# EAGLE design main_board (EAGLE 5.10)
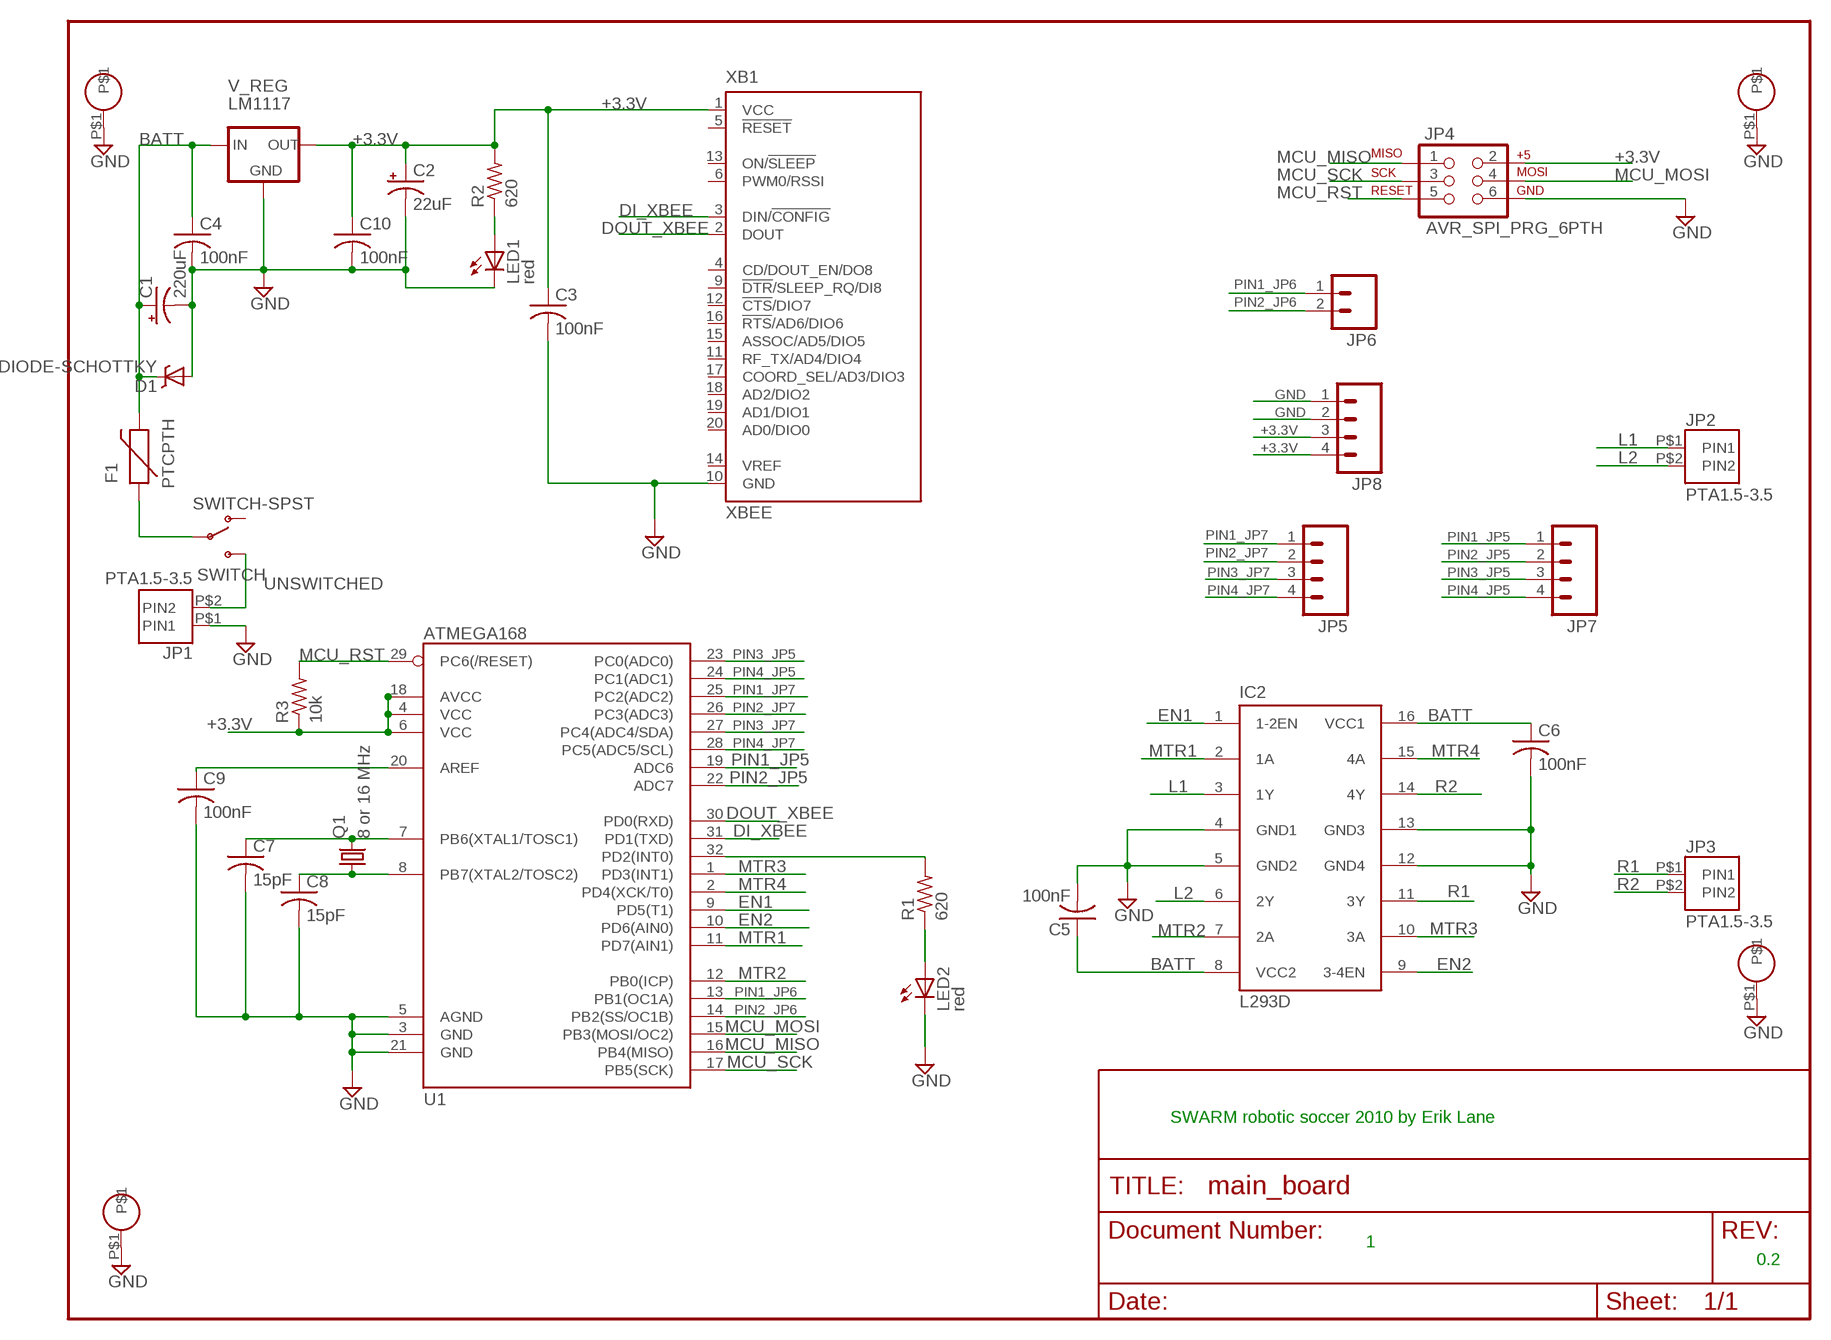
[diagram p0: schematic, sheet 1]

## Parts
C1  220uF  CPOL-USE5-6  [E5-6]
C2  22uF  CPOL-USE5-6  [E5-6]
C3  100nF  C-US050-024X044  [C050-024X044]
C4  100nF  C-US050-024X044  [C050-024X044]
C5  100nF  C-US050-024X044  [C050-024X044]
C6  100nF  C-US050-024X044  [C050-024X044]
C7  15pF  C-US050-024X044  [C050-024X044]
C8  15pF  C-US050-024X044  [C050-024X044]
C9  100nF  C-US050-024X044  [C050-024X044]
C10  100nF  C-US050-024X044  [C050-024X044]
D1  DIODE-SCHOTTKY  [SCHOTTKY]
F1  PTCPTH  [PTC]
IC2  L293D  [DIL16]
JP1  PTA1.5-3.5  [PTA1.5-3.5]
JP2  PTA1.5-3.5  [PTA1.5-3.5]
JP3  PTA1.5-3.5  [PTA1.5-3.5]
JP4  AVR_SPI_PRG_6PTH  [2X3]
JP5  M041X04_NO_SILK  [1X04_NO_SILK]
JP6  M02PTH  [1X02]
JP7  M041X04_NO_SILK  [1X04_NO_SILK]
JP8  M041X04_NO_SILK  [1X04_NO_SILK]
LED1  red  LED3MM  [LED3MM]
LED2  red  LED3MM  [LED3MM]
Q1  8 or 16 MHz  CRYSTALHC49US  [HC49US]
R1  620  R-US_0204/5  [0204/5]
R2  620  R-US_0204/5  [0204/5]
R3  10k  R-US_0204/5  [0204/5]
SWITCH  SWITCH-SPST  [SWITCH]
U1  ATMEGA168  [TQFP32-08]
U$2  BOARD-MOUNT  [MOUNT]
U$3  BOARD-MOUNT  [MOUNT]
U$4  BOARD-MOUNT  [MOUNT]
U$5  BOARD-MOUNT  [MOUNT]
V_REG  LM1117  V_REG_LM1117_SOT223  [SOT223]
XB1  XBEE  [XBEE]

## Nets
+3.3V [3.3V]: C2.+ C3.1 C10.1 JP4.2 JP8.3 JP8.4 R2.2 R3.1 U1.4(VCC) U1.6(VCC) U1.18(AVCC) V_REG.2(OUT) XB1.1(VCC)
BATT [power]: C1.+ C4.1 C5.1 C6.1 D1.1(C) F1.P$2 IC2.8(VCC2) IC2.16(VCC1) V_REG.3(IN)
DI_XBEE: U1.31(PD1(TXD)) XB1.3(DIN/!CONFIG)
DOUT_XBEE: U1.30(PD0(RXD)) XB1.2(DOUT)
EN1: IC2.1(1-2EN) U1.9(PD5(T1))
EN2: IC2.9(3-4EN) U1.10(PD6(AIN0))
GND: C1.- C2.- C3.2 C4.2 C5.2 C6.2 C7.2 C8.2 C9.2 C10.2 D1.2(A) IC2.4(GND1) IC2.5(GND2) IC2.12(GND4) IC2.13(GND3) JP1.P$1(PIN1) JP4.6 JP8.1 JP8.2 LED1.K(C) LED2.K(C) U1.3(GND) U1.5(AGND) U1.21(GND) U$2.P$1 U$3.P$1 U$4.P$1 U$5.P$1 V_REG.1(GND) XB1.10(GND)
L1 [motor]: IC2.3(1Y) JP2.P$1(PIN1)
L2 [motor]: IC2.6(2Y) JP2.P$2(PIN2)
MCU_MISO: JP4.1 U1.16(PB4(MISO))
MCU_MOSI: JP4.4 U1.15(PB3(MOSI/OC2))
MCU_RST: JP4.5 R3.2 U1.29(PC6(/RESET))
MCU_SCK: JP4.3 U1.17(PB5(SCK))
MTR1: IC2.2(1A) U1.11(PD7(AIN1))
MTR2: IC2.7(2A) U1.12(PB0(ICP))
MTR3: IC2.10(3A) U1.1(PD3(INT1))
MTR4: IC2.15(4A) U1.2(PD4(XCK/T0))
N$1 [power]: F1.P$1 SWITCH.2(P)
N$2: R1.2 U1.32(PD2(INT0))
N$3: C7.1 Q1.2 U1.7(PB6(XTAL1/TOSC1))
N$4: C8.1 Q1.1 U1.8(PB7(XTAL2/TOSC2))
N$5: C9.1 U1.20(AREF)
N$6: LED1.A R2.1
N$7: LED2.A R1.1
PIN1_JP5: JP7.1 U1.19(ADC6)
PIN1_JP6: JP6.1 U1.13(PB1(OC1A))
PIN1_JP7: JP5.1 U1.25(PC2(ADC2))
PIN2_JP5: JP7.2 U1.22(ADC7)
PIN2_JP6: JP6.2 U1.14(PB2(SS/OC1B))
PIN2_JP7: JP5.2 U1.26(PC3(ADC3))
PIN3_JP5: JP7.3 U1.23(PC0(ADC0))
PIN3_JP7: JP5.3 U1.27(PC4(ADC4/SDA))
PIN4_JP5: JP7.4 U1.24(PC1(ADC1))
PIN4_JP7: JP5.4 U1.28(PC5(ADC5/SCL))
R1 [motor]: IC2.11(3Y) JP3.P$1(PIN1)
R2 [motor]: IC2.14(4Y) JP3.P$2(PIN2)
UNSWITCHED [power]: JP1.P$2(PIN2) SWITCH.3(S)
Unconnected: SWITCH.1(O) XB1.4(CD/DOUT_EN/DO8) XB1.5(!RESET) XB1.6(PWM0/RSSI) XB1.9(!DTR!/SLEEP_RQ/DI8) XB1.11(RF_TX/AD4/DIO4) XB1.12(!CTS!/DIO7) XB1.13(ON/!SLEEP) XB1.14(VREF) XB1.15(ASSOC/AD5/DIO5) XB1.16(!RTS!/AD6/DIO6) XB1.17(COORD_SEL/AD3/DIO3) XB1.18(AD2/DIO2) XB1.19(AD1/DIO1) XB1.20(AD0/DIO0)

## Notes on the sheet
- SWARM robotic soccer 2010 by Erik Lane
- 1
- 0.2

## Library data of the parts
C1 C2 = rcl:CPOL-US: POLARIZED CAPACITOR, American symbol
C3-C10 = rcl:C-US: CAPACITOR, American symbol
D1 = ErikLane:DIODE-SCHOTTKY
F1 = SparkFun:PTC: Resettable Fuse PTC Resettable Fuse. Spark Fun Electronics SKU : COM-08357
IC2 = st-microelectronics:L293D: PUSH-PULL 4 CHANNEL DRIVER
JP1-JP3 = ErikLane:PTA1.5-3.5
JP4 = SparkFun:AVR_SPI_PRG_6: AVR ISP 6 Pin This is the reduced ISP connector for AVR programming. Common on Arduino. This footprint will take up less PCB space and can be used with a 10-pin to 6-pin adapter such as SKU: BOB-08508
JP5 JP7 JP8 = SparkFun:M04: Header 4 Standard 4-pin 0.1" header. Use with straight break away headers (SKU : PRT-00116), right angle break away headers (PRT-00553), swiss pins (PRT-00743), machine pins (PRT-00117), and female headers (PRT-00115). Molex polarized connector foot print use with SKU : PRT-08231 with associated crimp pins and housings.
JP6 = SparkFun:M02: Header 2 Standard 2-pin 0.1" header. Use with straight break away headers (SKU : PRT-00116), right angle break away headers (PRT-00553), swiss pins (PRT-00743), machine pins (PRT-00117), and female headers (PRT-00115). Molex polarized connector foot print use with SKU : PRT-08233 with associated crimp pins and housings.
LED1 LED2 = led:LED: LED OSRAM: - CHIPLED LG R971, LG N971, LY N971, LG Q971, LY Q971, LO R971, LY R971 LH N974, LH R974 LS Q976, LO Q976, LY Q976 LO Q996 - Hyper CHIPLED LW Q18S LB Q993, LB Q99A, LB R99A - SideLED LS A670, LO A670, LY A670, LG A670, LP A670 LB A673, LV A673, LT A673, LW A673 LH A674 LY A675 LS A676, LA A676, LO A676, LY A676, LW A676 LS A679, LY A679, LG A679 - Hyper Micro SIDELED® LS Y876, LA Y876, LO Y876, LY Y876 LT Y87S - SmartLED LW L88C, LW L88S LB L89C, LB L89S, LG L890 LS L89K, LO L89K, LY L89K LS L896, LA L896, LO L896, LY L896 - TOPLED LS T670, LO T670, LY T670, LG T670, LP T670 LSG T670, LSP T670, LSY T670, LOP T670, LYG T670 LG T671, LOG T671, LSG T671 LB T673, LV T673, LT T673, LW T673 LH T674 LS T676, LA T676, LO T676, LY T676, LB T676, LH T676, LSB T676, LW T676 LB T67C, LV T67C, LT T67C, LS T67K, LO T67K, LY T67K, LW E67C LS E67B, LA E67B, LO E67B, LY E67B, LB E67C, LV E67C, LT E67C LW T67C LS T679, LY T679, LG T679 LS T770, LO T770, LY T770, LG T770, LP T770 LB T773, LV T773, LT T773, LW T773 LH T774 LS E675, LA E675, LY E675, LS T675 LS T776, LA T776, LO T776, LY T776, LB T776 LHGB T686 LT T68C, LB T68C - Hyper Mini TOPLED® LB M676 - Mini TOPLED Santana® LG M470 LS M47K, LO M47K, LY M47K Source: http://www.osram.convergy.de LUXEON: - LUMILED® LXK2-PW12-R00, LXK2-PW12-S00, LXK2-PW14-U00, LXK2-PW14-V00 LXK2-PM12-R00, LXK2-PM12-S00, LXK2-PM14-U00 LXK2-PE12-Q00, LXK2-PE12-R00, LXK2-PE12-S00, LXK2-PE14-T00, LXK2-PE14-U00 LXK2-PB12-K00, LXK2-PB12-L00, LXK2-PB12-M00, LXK2-PB14-N00, LXK2-PB14-P00, LXK2-PB14-Q00 LXK2-PR12-L00, LXK2-PR12-M00, LXK2-PR14-Q00, LXK2-PR14-R00 LXK2-PD12-Q00, LXK2-PD12-R00, LXK2-PD12-S00 LXK2-PH12-R00, LXK2-PH12-S00 LXK2-PL12-P00, LXK2-PL12-Q00, LXK2-PL12-R00 Source: www.luxeon.com KINGBRIGHT: KA-3528ASYC Source: www.kingbright.com
Q1 = SparkFun:CRYSTAL: Crystals Various standard crystals. Proven footprints. Spark Fun Electronics SKU : COM-00534
R1-R3 = rcl:R-US_: RESISTOR, American symbol
SWITCH = ErikLane:SWITCH-SPST
U1 = SparkFun:ATMEGA168
U$2-U$5 = ErikLane:BOARD-MOUNT
V_REG = SparkFun:V_REG_LM1117_SOT223: LM1117 because SparkFun didn't have one already set up to do this.
XB1 = maxstream:XBEE: XBee (TM) /XBee-PRO(TM) OEM RF Modules Source: MaxStream, Inc. xbee_productmanual.pdf

## Net classes
0 default: width 0.203 mm, clearance 0.127 mm
1 power: width 1.016 mm, clearance 0.127 mm
2 motor: width 0.406 mm, clearance 0.127 mm
3 3.3V: width 0.406 mm, clearance 0.127 mm

## Board
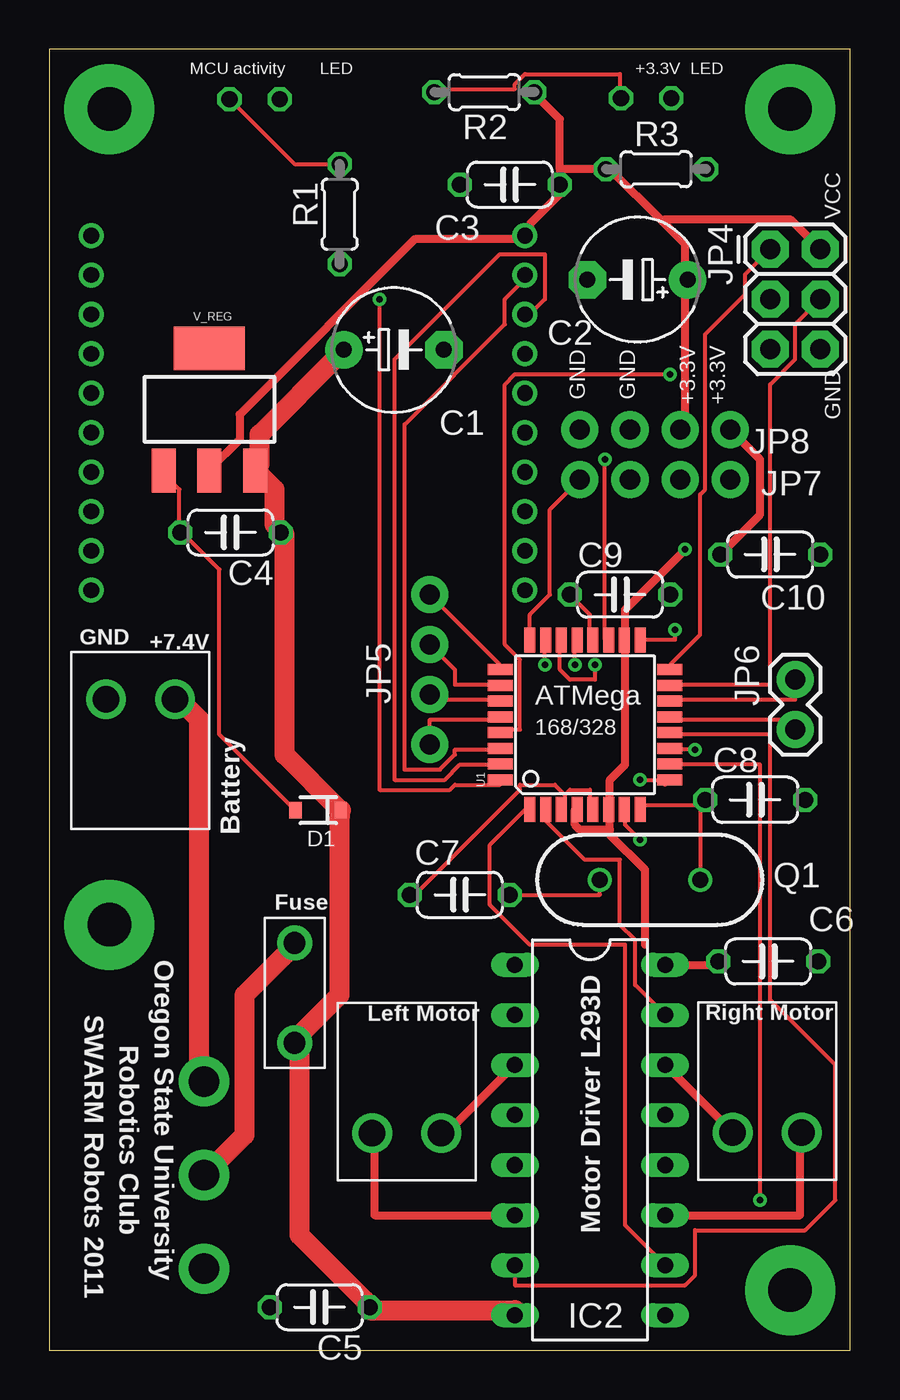
[diagram p1: board, top side]
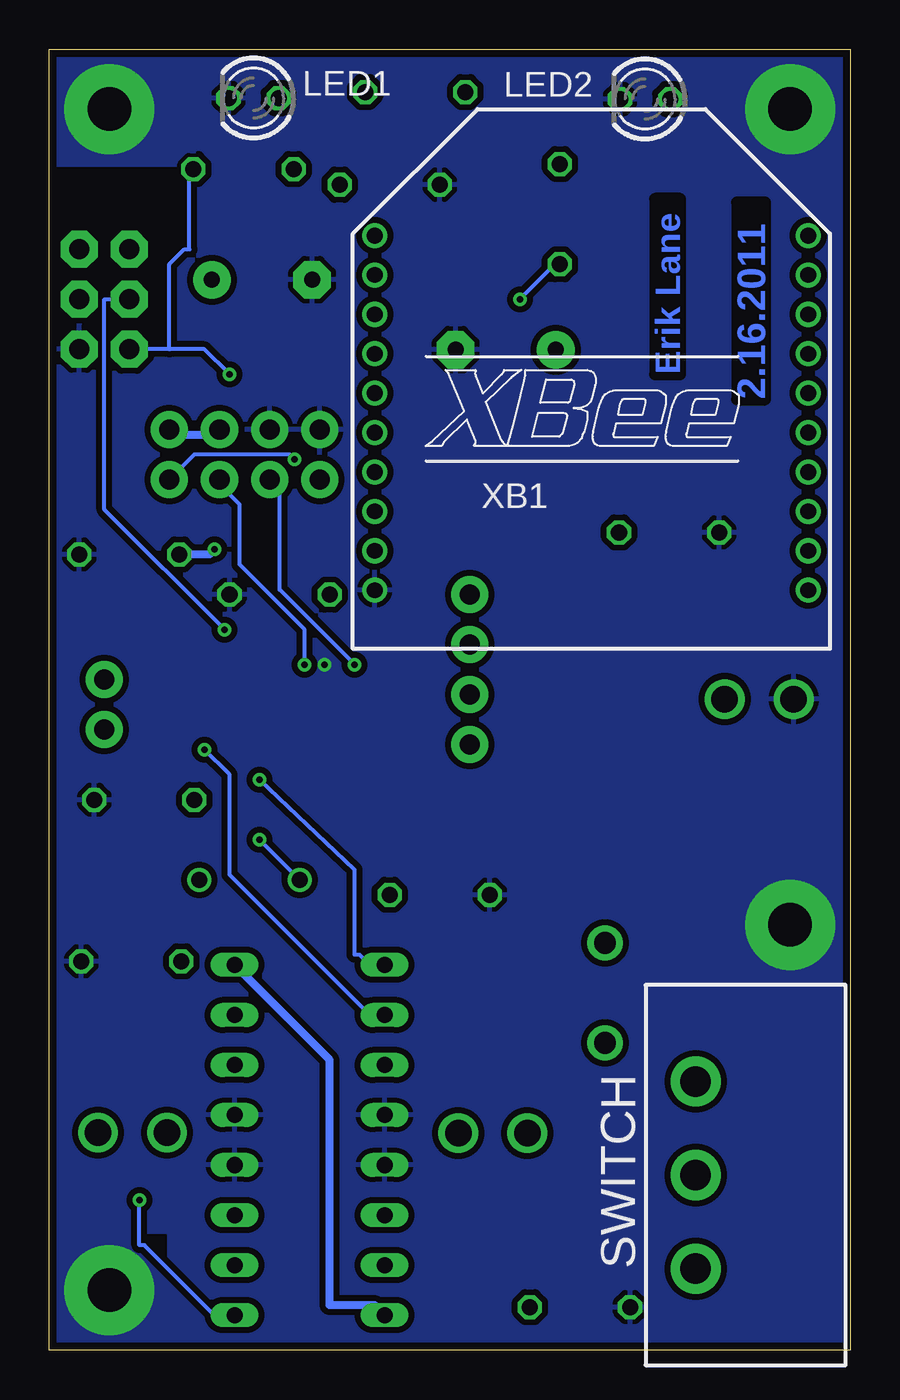
[diagram p2: board, bottom side, seen from below]

Size 40.64 x 66.03 mm. Coordinates in mm from the lower left corner, seen from the top.
Outline: 0,0 40.64,0 40.64,66.03 0,66.03 0,0
Copper layers (1*16): Top 0.0356mm / dielectric 1.5011mm / Bottom 0.0356mm
Design rules "LaenPCBOrder *": minimum track width 6mil, minimum drill 13mil, track to track 8mil, track to pad 8mil, pad to pad 8mil, via to via 8mil, smd to smd 6mil, copper to edge 15mil, drill to drill 6mil, minimum pad ring 7mil, minimum via ring 7mil, stop-mask expansion 4mil, vias tented up to drill 0mil, thermal gap 10mil

### Footprints (pad centres in the part's own frame; a part is rotated, then mirrored left to right if it is on the bottom)
E5-6 = drill 0.813 pad 1.905 round: + -2.54,0 | drill 0.813 pad 1.905 octagon: - 2.54,0
C050-024X044 = drill 0.813 octagon: 1 -2.54,0; 2 2.54,0
SCHOTTKY = smd 0.63 x 0.83: 1 -1.15,0; 2 1.15,0
PTC = drill 1.1 pad 1.778 round: P$1 -2.54,0; P$2 2.54,0
DIL16 = drill 0.813 long: 1 -8.89,-3.81; 2 -6.35,-3.81; 3 -3.81,-3.81; 4 -1.27,-3.81; 5 1.27,-3.81; 6 3.81,-3.81; 7 6.35,-3.81; 8 8.89,-3.81; 9 8.89,3.81; 10 6.35,3.81; 11 3.81,3.81; 12 1.27,3.81; 13 -1.27,3.81; 14 -3.81,3.81; 15 -6.35,3.81; 16 -8.89,3.81
PTA1.5-3.5 = drill 1.346 round: P$1 3.5,0; P$2 0,0
2X3 = drill 1.016 pad 1.88 octagon: 1 0,0; 2 0,2.54; 3 2.54,0; 4 2.54,2.54; 5 5.08,0; 6 5.08,2.54
1X04_NO_SILK = drill 1.016 pad 1.88 round: 1 0,0; 2 2.54,0; 3 5.08,0; 4 7.62,0
1X02 = drill 1.016 pad 1.88 round: 1 0,0; 2 2.54,0
LED3MM = drill 0.813 octagon: A -1.27,0; K 1.27,0
HC49US = drill 0.813 round: 1 -2.54,0; 2 2.54,0
0204/5 = drill 0.813 octagon: 1 -2.54,0; 2 2.54,0
SWITCH = drill 1.549 pad 2.54 round: 1 0,4.75; 2 0,0; 3 0,-4.75
TQFP32-08 = smd 1.27 x 0.559: 1 -4.293,2.8; 2 -4.293,2; 3 -4.293,1.2; 4 -4.293,0.4; 5 -4.293,-0.4; 6 -4.293,-1.2; 7 -4.293,-2; 8 -4.293,-2.8; 17 4.293,-2.8; 18 4.293,-2; 19 4.293,-1.2; 20 4.293,-0.4; 21 4.293,0.4; 22 4.293,1.2; 23 4.293,2; 24 4.293,2.8 | smd 0.559 x 1.27: 9 -2.8,-4.293; 10 -2,-4.293; 11 -1.2,-4.293; 12 -0.4,-4.293; 13 0.4,-4.293; 14 1.2,-4.293; 15 2,-4.293; 16 2.8,-4.293; 25 2.8,4.293; 26 2,4.293; 27 1.2,4.293; 28 0.4,4.293; 29 -0.4,4.293; 30 -1.2,4.293; 31 -2,4.293; 32 -2.8,4.293
MOUNT = drill 2.21 pad 4.572 round: P$1 0,0
SOT223 = smd 1.219 x 2.235: 1 -2.311,-3.099; 2 0,-3.099; 3 2.311,-3.099 | smd 3.6 x 2.2: 4 0,3.099
XBEE = drill 0.8 pad 1.27 round: 1 -11,9; 2 -11,7; 3 -11,5; 4 -11,3; 5 -11,1; 6 -11,-1; 7 -11,-3; 8 -11,-5; 9 -11,-7; 10 -11,-9; 11 11,-9; 12 11,-7; 13 11,-5; 14 11,-3; 15 11,-1; 16 11,1; 17 11,3; 18 11,5; 19 11,7; 20 11,9

### Placement (x,y rotation side)
C1  17.48,50.78 0 top
C2  29.84,54.33 180 top
C3  23.37,59.16 180 top
C4  9.19,41.5 180 top
C5  13.72,2.18 180 top
C6  36.47,19.74 0 top
C7  20.83,23.11 180 top
C8  35.81,27.94 0 top
C9  28.96,38.35 0 top
C10  36.58,40.39 0 top
D1  13.64,27.41 180 top
F1  12.45,18.14 270 top
IC2  27.43,10.67 270 top
JP1  6.38,33.05 180 top
JP2  16.38,11.02 0 top
JP3  34.67,11.05 0 top
JP4  36.58,55.88 270 top
JP5  19.3,38.35 270 top
JP6  37.85,31.5 90 top
JP7  34.54,44.2 180 top
JP8  26.92,46.74 0 top
LED1  30.28,63.55 180 bottom
LED2  10.41,63.5 180 bottom
Q1  30.48,23.88 180 top
R1  14.73,57.66 270 top
R2  22.07,63.86 0 top
R3  30.78,59.94 0 top
SWITCH  7.85,8.89 180 bottom
U1  27.18,31.75 90 top
U$2  37.59,3.05 0 top
U$3  3.05,21.59 0 top
U$4  3.05,62.99 0 top
U$5  37.59,62.99 0 top
V_REG  8.13,47.75 0 top
XB1  13.13,47.57 0 bottom

### Tracks (layer width: path | path; a pad name or v marks a point on that pad's centre or on a via)
+3.3V  (via drill 0.33)
  Top 0.406: C3.1 25.91,58.67 24.38,57.15 24.38,56.64 XB1.1 24.13,56.39 18.54,56.39 9.65,47.5 9.65,46.23 8.13,44.7 V_REG.2 | R2.2 24.64,63.75 25.91,62.48 25.91,59.94 | 25.91,59.94 C3.1 | C3.1 25.91,58.93 | 28.45,26.42 26.92,26.42 26.67,26.67 26.67,27.43 U1.4 | 28.45,26.42 28.45,27.43 U1.6 28.45,27.69 28.45,28.96 29.21,29.72 29.21,35.81 U1.18 29.21,36.07 29.21,37.59 v32.26,40.64 | 30.23,20.57 30.23,24.38 28.45,26.16 28.45,26.42 | C10.1 36.07,42.42 36.07,45.21 JP8.4 | 25.91,59.94 R3.1 28.45,59.94 31.11,57.28 | 31.11,57.28 32.26,56.13 32.26,54.36 C2.+ 32.26,54.1 32.26,46.99 JP8.3 | JP4.2 37.59,57.4 31.24,57.4 31.11,57.28
  Bottom 0.406: JP8.4 34.29,46.48 32.26,46.48 JP8.3 | v32.26,40.64 32.51,40.39 C10.1
BATT
  Top 0.406: IC2.16 33.78,19.56 C6.1
  Top 1.016: IC2.8 23.62,2.03 16.26,2.03 C5.1 16,2.54 12.7,5.84 12.7,15.24 F1.P$2 12.45,15.75 14.73,18.03 14.73,26.92 D1.1 14.73,27.43 11.94,30.23 11.94,41.4 C4.1 11.43,41.91 11.43,43.69 10.67,44.45 V_REG.3 10.67,44.96 10.67,46.48 14.73,50.55 C1.+
  Bottom 0.406: IC2.16 26.42,14.73 26.42,2.29 24.13,2.29 IC2.8
DI_XBEE
  Top 0.203: U1.31 22.86,29.72 20.83,29.72 20.07,28.96 17.53,28.96 17.53,50.29 22.86,55.63 25.15,55.63 25.15,53.34 24.38,52.58 XB1.3
DOUT_XBEE
  Top 0.203: U1.30 22.86,30.48 20.57,30.48 20.57,30.23 19.81,29.46 18.03,29.46 18.03,46.99 23.11,52.07 23.11,53.34 24.13,54.36 XB1.2
EN1  (via drill 0.33)
  Top 0.203: 31.24,28.7 U1.9 31.24,28.96 v29.97,28.96
  Bottom 0.203: v29.97,28.96 25.15,24.38 25.15,20.07 24.89,20.07 24.38,19.56 IC2.1
EN2  (via drill 0.33)
  Top 0.203: v36.07,7.62 36.07,29.72 31.5,29.72 U1.10
  Bottom 0.203: v36.07,7.62 36.07,5.33 35.81,5.33 32.26,1.78 IC2.9
GND  (via drill 0.33)
  Top 0.203: 26.16,28.19 26.16,27.69 U1.3 | 26.16,28.19 26.42,28.45 27.43,28.45 27.43,27.69 U1.5 | v26.67,34.8 26.67,35.81 U1.21 | 26.16,28.19 25.65,28.7 23.88,28.7 23.88,28.45 18.54,23.11 C7.2 | V_REG.1 5.84,44.45 6.6,43.69 6.6,41.66 C4.2 6.86,41.4 8.64,39.62 8.64,31.24 12.45,27.43 D1.2
  pour Bottom (isolate 0.305): 6.22,65.81 33.68,65.86 34.14,60.27 40.54,60.15 40.41,5.94 34.54,6.05 34.52,0.13 0.23,0.2 0.25,18.44 6.71,18.49 6.6,24.77 0.18,24.84 0.2,59.87 5.66,59.92 6.35,62.51
  pour Bottom (isolate 0.305, no thermals): 33.73,6.07 40.44,6.07 40.46,0.13 33.45,0.18
  pour Bottom (isolate 0.305, no thermals): 0.13,24.84 6.88,24.84 6.86,18.52 0.18,18.52
  pour Bottom (no thermals): 33.53,65.79 40.39,65.79 40.39,60.2 33.27,60.2
  pour Bottom (no thermals): 0.25,65.79 6.6,65.79 6.1,59.94 0.25,59.94
L1
  Top 0.406: IC2.3 20.07,10.92 JP2.P$1
L2
  Top 0.406: IC2.6 16.51,6.86 16.51,10.92 JP2.P$2
MCU_MISO
  Top 0.203: JP4.1 35.31,54.61 35.31,53.59 33.27,51.56 33.27,43.69 33.02,43.43 33.02,36.32 31.5,34.8 U1.16
MCU_MOSI
  Top 0.203: JP4.4 37.85,52.07 37.85,50.29 36.58,49.02 36.58,33.78 31.5,33.78 U1.15
MCU_RST  (via drill 0.33)
  Top 0.203: v31.5,49.53 23.62,49.53 23.11,49.02 23.11,35.81 23.88,35.05 23.88,31.5 23.11,31.5 U1.29
  Bottom 0.203: v31.5,49.53 32.77,50.8 34.54,50.8 | 34.54,50.8 JP4.5 | 34.54,50.8 34.54,55.12 33.78,55.88 33.53,55.88 33.53,59.94 R3.2
MCU_SCK  (via drill 0.33)
  Top 0.203: v31.75,36.58 31.75,36.07 30.23,36.07 U1.17
  Bottom 0.203: v31.75,36.58 37.85,42.67 37.85,53.34 JP4.3
MTR1  (via drill 0.33)
  Top 0.203: v32.77,30.48 31.5,30.48 U1.11
  Bottom 0.203: v32.77,30.48 31.5,29.21 31.5,24.13 24.38,17.02 IC2.2
MTR2
  Top 0.203: IC2.7 23.62,3.3 32.26,3.3 32.77,3.81 32.77,6.1 38.35,6.1 39.88,7.62 39.88,14.48 36.58,17.78 36.58,31.24 31.5,31.24 U1.12
MTR3
  Top 0.203: IC2.10 29.21,6.35 29.21,20.57 24.38,20.57 22.35,22.61 22.35,25.65 24.13,27.43 U1.1
MTR4
  Top 0.203: IC2.15 29.72,18.54 29.72,20.83 28.96,21.59 28.96,24.89 27.18,24.89 25.15,26.92 25.15,27.43 U1.2
N$1
  Top 1.016: F1.P$1 12.45,20.57 9.91,18.03 9.91,10.92 7.87,8.89 SWITCH.2
N$2  (via drill 0.33)
  Top 0.203: v16.76,53.34 16.76,28.45 20.32,28.45 20.57,28.7 22.86,28.7 U1.32
  Bottom 0.203: v16.76,53.34 14.99,55.12 R1.2
N$3  (via drill 0.33)
  Top 0.203: v29.97,25.91 29.21,26.67 29.21,27.43 U1.7 | C7.1 27.94,23.11 Q1.2
  Bottom 0.203: Q1.2 v29.97,25.91
N$4
  Top 0.203: 33.02,27.69 33.27,27.69 C8.1 33.02,27.69 | 33.02,27.69 30.23,27.69 U1.8 | 33.02,27.69 Q1.1
N$5
  Top 0.203: C9.1 27.43,37.34 27.43,36.07 U1.20
N$6
  Top 0.203: R2.1 19.56,64.01 23.62,64.01 23.62,64.26 24.13,64.77 28.96,64.77 28.96,63.75 LED1.A
N$7
  Top 0.203: LED2.A 12.45,60.2 R1.1
PIN1_JP5  (via drill 0.33)
  Top 0.203: v28.19,45.21 28.19,36.07 U1.19
  Bottom 0.203: v28.19,45.21 28.45,45.47 33.27,45.47 JP7.1
PIN1_JP6
  Top 0.203: JP6.1 37.85,32 31.5,32 U1.13
PIN1_JP7
  Top 0.203: JP5.1 22.86,34.8 U1.25
PIN2_JP5  (via drill 0.33)
  Top 0.203: v27.69,34.8 27.69,34.04 26.42,34.04 25.91,34.54 25.91,35.81 U1.22
  Bottom 0.203: v27.69,34.8 27.69,36.58 30.99,39.88 30.99,42.93 32,43.94 JP7.2
PIN2_JP6
  Top 0.203: JP6.2 37.85,33.02 31.5,33.02 U1.14
PIN2_JP7
  Top 0.203: JP5.2 20.57,34.54 20.57,33.78 22.86,33.78 U1.26
PIN3_JP5  (via drill 0.33)
  Top 0.203: v25.15,34.8 25.15,35.81 U1.23
  Bottom 0.203: v25.15,34.8 28.96,38.61 28.96,44.2 JP7.3
PIN3_JP7
  Top 0.203: JP5.3 19.3,33.02 22.86,33.02 U1.27
PIN4_JP5
  Top 0.203: JP7.4 25.4,42.67 25.4,38.35 24.38,37.34 24.38,36.07 U1.24
PIN4_JP7
  Top 0.203: JP5.4 19.3,32 22.86,32 U1.28
R1
  Top 0.406: IC2.11 38.1,6.86 38.1,10.92 JP3.P$1
R2
  Top 0.406: IC2.14 JP3.P$2
UNSWITCHED
  Top 1.016: JP1.P$2 6.6,33.02 7.62,32 7.62,13.72 SWITCH.3

### Text on the board
Bottom: Erik Lane | 2.16.2011
tPlace: MCU activity | LED | +3.3V | LED | VCC | GND | GND | +3.3V | +3.3V | GND | GND | +7.4V | ATMega | 168/328 | Battery | Fuse | Oregon State University | Motor Driver L293D | Left Motor | SWARM Robots 2011 | Right Motor | Robotics Club